# EAGLE design ugs preamp (EAGLE 6.3)
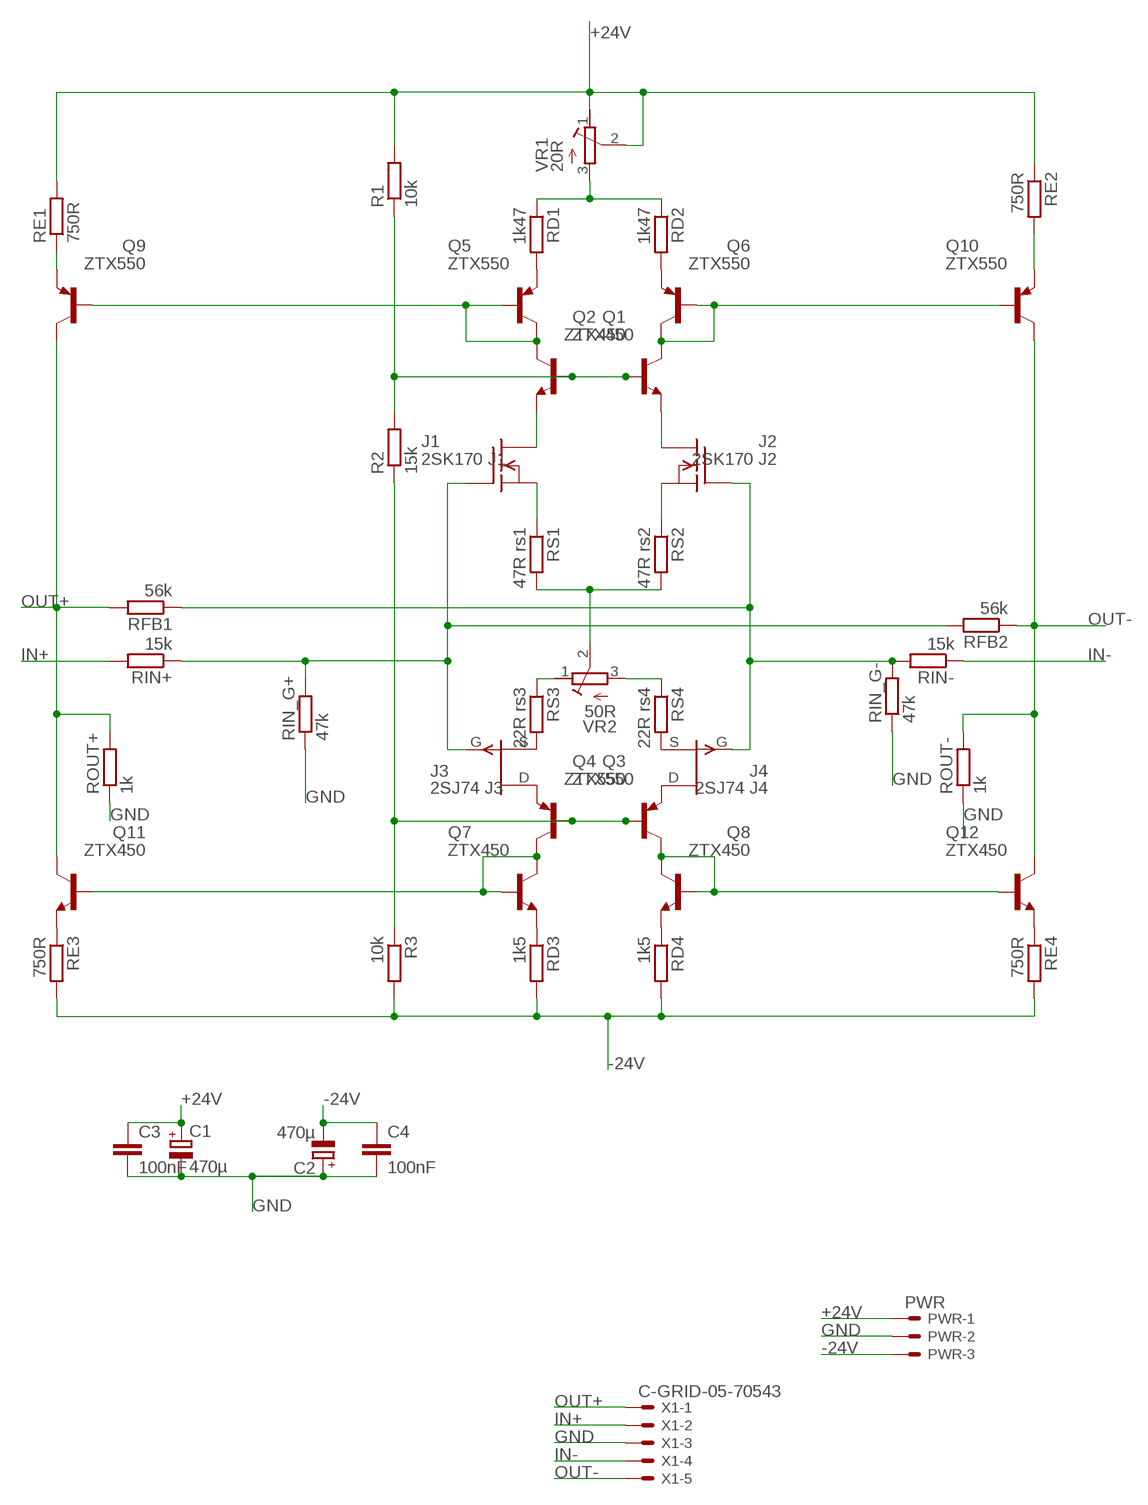
[diagram p0: schematic, sheet 1]

## Parts
C1  470µ  CPOL-EUE7.5-16  [E7,5-16]
C2  470µ  CPOL-EUE7.5-16  [E7,5-16]
C3  100nF  C-EU050-025X075  [C050-025X075]
C4  100nF  C-EU050-025X075  [C050-025X075]
J1  2SK170 J1  BSS101  [TO92]
J2  2SK170 J2  BSS101  [TO92]
J3  2SJ74 J3  2N3820  [TO92]
J4  2SJ74 J4  2N3820  [TO92]
PWR  PWR  C-GRID-03-70543  [70543-03]
Q1  ZTX450  -NPN-TO92-EBC  [TO92-EBC]
Q2  ZTX450  -NPN-TO92-EBC  [TO92-EBC]
Q3  ZTX550  BC328-16-PNP-TO92-EBC  [TO92-EBC]
Q4  ZTX550  BC328-16-PNP-TO92-EBC  [TO92-EBC]
Q5  ZTX550  BC328-16-PNP-TO92-EBC  [TO92-EBC]
Q6  ZTX550  BC328-16-PNP-TO92-EBC  [TO92-EBC]
Q7  ZTX450  -NPN-TO92-EBC  [TO92-EBC]
Q8  ZTX450  -NPN-TO92-EBC  [TO92-EBC]
Q9  ZTX550  BC328-16-PNP-TO92-EBC  [TO92-EBC]
Q10  ZTX550  BC328-16-PNP-TO92-EBC  [TO92-EBC]
Q11  ZTX450  -NPN-TO92-EBC  [TO92-EBC]
Q12  ZTX450  -NPN-TO92-EBC  [TO92-EBC]
R1  10k  R-EU_0207/10  [0207/10]
R2  15k  R-EU_0207/10  [0207/10]
R3  10k  R-EU_0207/10  [0207/10]
RD1  1k47  R-EU_0207/10  [0207/10]
RD2  1k47  R-EU_0207/10  [0207/10]
RD3  1k5  R-EU_0207/10  [0207/10]
RD4  1k5  R-EU_0207/10  [0207/10]
RE1  750R  R-EU_0207/10  [0207/10]
RE2  750R  R-EU_0207/10  [0207/10]
RE3  750R  R-EU_0207/10  [0207/10]
RE4  750R  R-EU_0207/10  [0207/10]
RFB1  56k  R-EU_0207/10  [0207/10]
RFB2  56k  R-EU_0207/10  [0207/10]
RIN+  15k  R-EU_0207/10  [0207/10]
RIN-  15k  R-EU_0207/10  [0207/10]
RIN_G+  47k  R-EU_0207/10  [0207/10]
RIN_G-  47k  R-EU_0207/10  [0207/10]
ROUT+  1k  R-EU_0207/10  [0207/10]
ROUT-  1k  R-EU_0207/10  [0207/10]
RS1  47R rs1  R-EU_0207/10  [0207/10]
RS2  47R rs2  R-EU_0207/10  [0207/10]
RS3  22R rs3  R-EU_0207/10  [0207/10]
RS4  22R rs4  R-EU_0207/10  [0207/10]
VR1  20R  R-TRIMMT93YA  [RTRIMT93YA]
VR2  50R  R-TRIMMT93YA  [RTRIMT93YA]
X1  C-GRID-05-70543  [70543-05]

## Nets
+24V [PWR]: C1.+ C3.1 PWR.1 R1.2 RE1.2 RE2.1 VR1.1(E) VR1.2(S)
-24V [PWR]: C2.- C4.1 PWR.3 R3.2 RD3.2 RD4.2 RE3.2 RE4.2
GND [PWR]: C1.- C2.+ C3.2 C4.2 PWR.2 RIN_G+.1 RIN_G-.1 ROUT+.1 ROUT-.1 X1.3
IN+: RIN+.2 X1.2
IN-: RIN-.1 X1.4
N$1: J3.3(D) Q3.E
N$2: RD1.1 RD2.1 VR1.3(A)
N$3: Q1.B Q2.B R1.1 R2.2
N$4: Q3.B Q4.B R2.1 R3.1
N$5: J4.3(D) Q4.E
N$6: J4.1(S) RS4.2
N$7: J3.1(S) RS3.2
N$8: Q10.E RE2.2
N$13: J2.2(G) J4.2(G) RFB1.1 RIN-.2 RIN_G-.2
N$14: RS1.2 RS2.2 VR2.2(S)
N$15: J2.1(S) RS2.1
N$18: Q5.E RD1.2
N$20: J1.1(S) RS1.1
N$21: RS3.1 VR2.1(E)
N$22: RS4.1 VR2.3(A)
N$23: J1.2(G) J3.2(G) RFB2.2 RIN+.1 RIN_G+.2
N$25: Q6.E RD2.2
N$26: Q11.E RE3.1
N$27: Q9.E RE1.1
N$30: Q8.E RD4.1
N$31: Q4.C Q8.B Q8.C Q12.B
N$32: Q7.E RD3.1
N$34: Q12.E RE4.1
N$35: Q2.C Q6.B Q6.C Q10.B
N$38: Q3.C Q7.B Q7.C Q11.B
N$39: J1.3(D) Q1.E
N$40: J2.3(D) Q2.E
N$41: Q1.C Q5.B Q5.C Q9.B
OUT+: Q9.C Q11.C RFB1.2 ROUT+.2 X1.1
OUT-: Q10.C Q12.C RFB2.1 ROUT-.2 X1.5

## Library data of the parts
C1 C2 = rcl:CPOL-EU: POLARIZED CAPACITOR, European symbol
C3 C4 = rcl:C-EU: CAPACITOR, European symbol
J1 J2 = transistor-fet:BSS101: N-Channel Enhancement MOSFET 200V; 0,16A; 11Ohm
J3 J4 = transistor-fet:2N3820: P-Channel Junction FET Source: http://www.fairchildsemi.com/ds/2N/2N3820.pdf
PWR = con-molex:C-GRID-03: CONNECTOR wire to board 2.54 mm (0.100") pitch header; OC_FARNELL: unknown; OC_NEWARK: unknown
Q1 Q2 Q7 Q8 Q11 Q12 = transistor:*-NPN-: NPN Transistror BF959 corrected 2008.03.06
Q3-Q6 Q9 Q10 = transistor:*-PNP-: PNP Transistror
R1-R3 RD1-RD4 RE1-RE4 RFB1 RFB2 RIN+ RIN- RIN_G+ RIN_G- ROUT+ ROUT- RS1-RS4 = rcl:R-EU_: RESISTOR, European symbol
VR1 VR2 = rcl:R-TRIMM: Trimm resistor
X1 = con-molex:C-GRID-05: CONNECTOR wire to board 2.54 mm (0.100") pitch header; OC_FARNELL: unknown; OC_NEWARK: unknown

## Net classes
0 Any: width 0.305 mm, clearance 0.152 mm
1 PWR: width 0.559 mm, clearance 0.152 mm

## Board
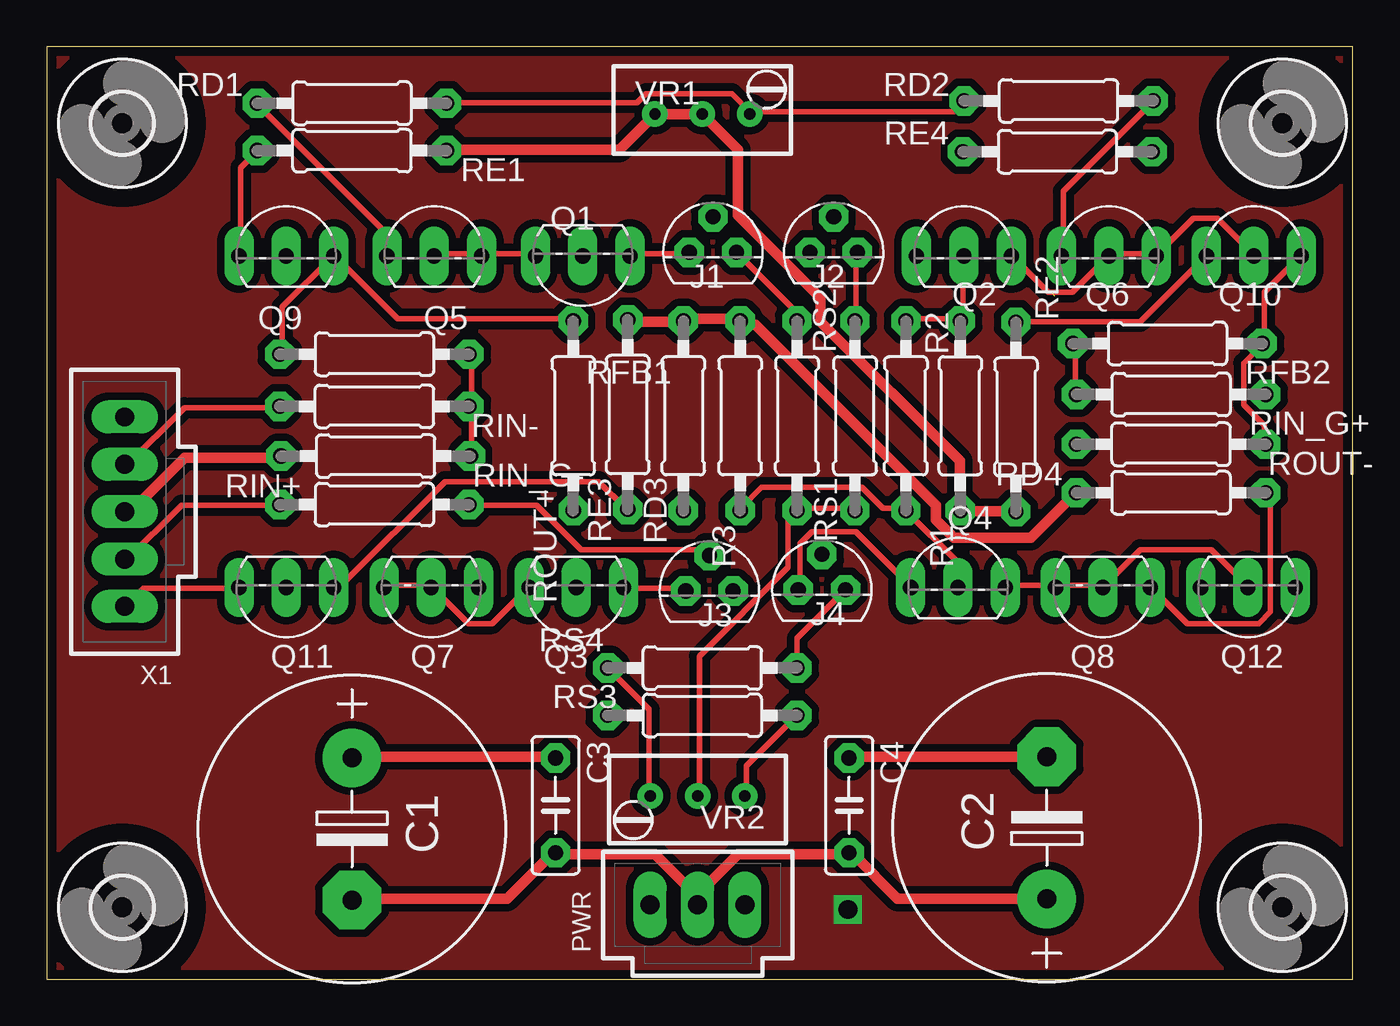
[diagram p1: board, top side]
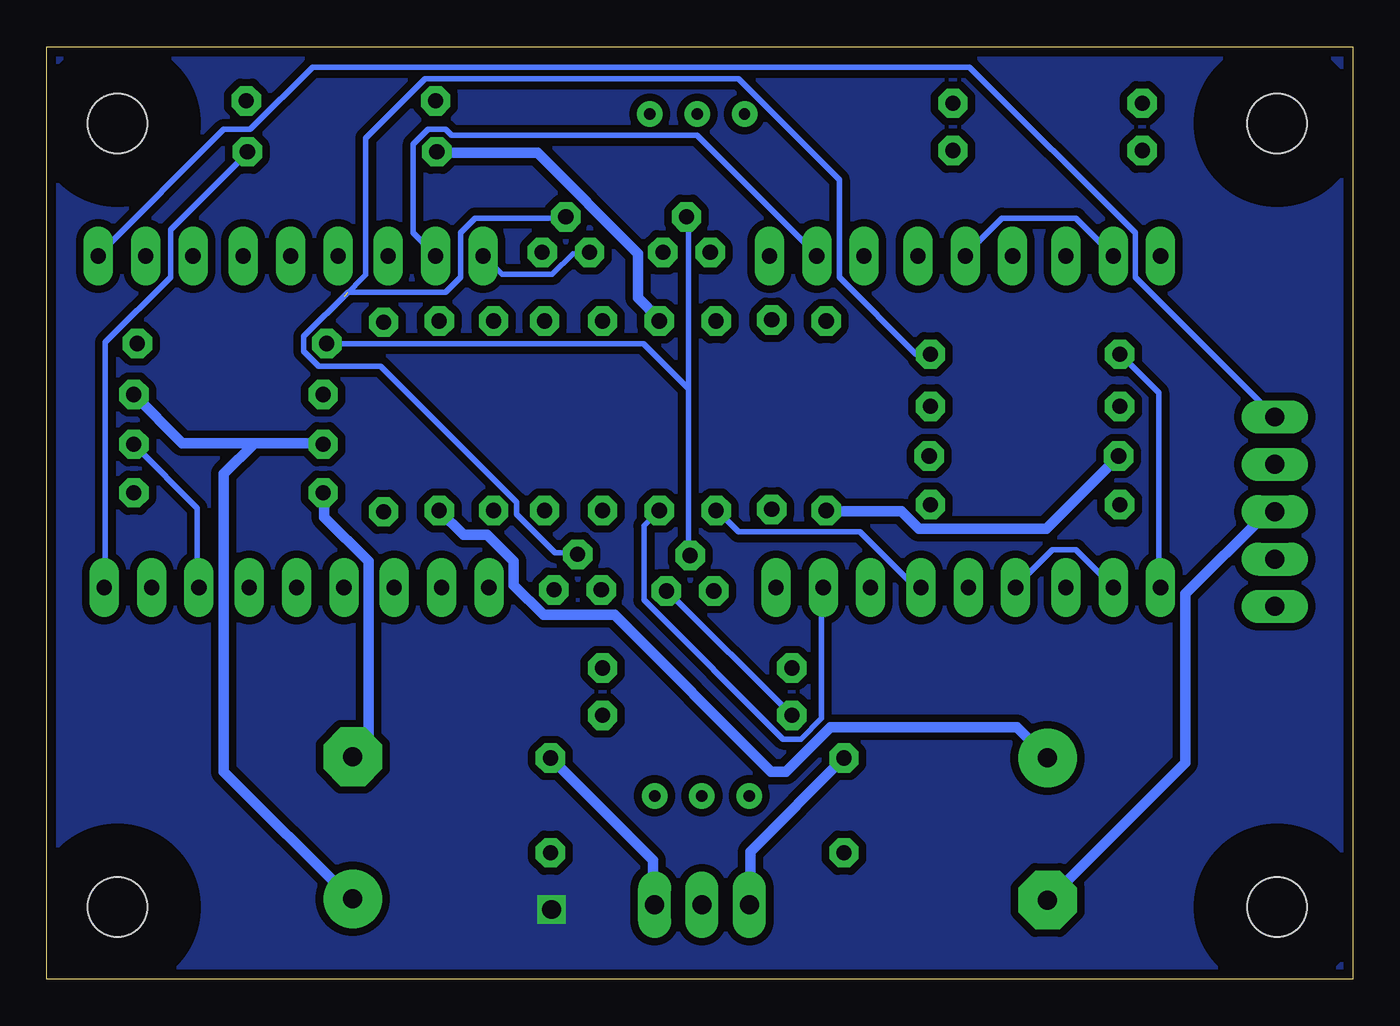
[diagram p2: board, bottom side, seen from below]

Size 70.08 x 50.03 mm. Coordinates in mm from the lower left corner, seen from the top.
Outline: 0,0 70.08,0 70.08,50.03 0,50.03 0,0
Copper layers (1*16): Top 0.035mm / dielectric 1.5mm / Bottom 0.035mm
Design rules "gael design rules": minimum track width 12mil, minimum drill 24mil, track to track 8mil, track to pad 8mil, pad to pad 8mil, via to via 8mil, smd to smd 8mil, copper to edge 20mil, drill to drill 8mil, minimum pad ring 15mil, minimum via ring 10mil, stop-mask expansion 4mil, vias tented up to drill 0mil, thermal gap 10mil

### Footprints (pad centres in the part's own frame; a part is rotated, then mirrored left to right if it is on the bottom)
E7,5-16 = drill 1.016 pad 3.15: + -3.81,0 | drill 1.016 pad 3.15 octagon: - 3.81,0
C050-025X075 = drill 0.813 octagon: 1 -2.54,0; 2 2.54,0
TO92 = drill 0.813 octagon: 1 1.27,0; 2 0,1.905; 3 -1.27,0
70543-03 = drill 1.016 long: 1 -2.54,0; 2 0,0; 3 2.54,0
TO92-EBC = drill 0.813 long: B 0,-1.27; C 2.54,-1.27; E -2.54,-1.27
0207/10 = drill 0.813 octagon: 1 -5.08,0; 2 5.08,0
3,2 = hole 3.2: 0,0
RTRIMT93YA = drill 0.61: 1 0,-2.54; 2 0,0; 3 0,2.54
70543-05 = drill 1.016 long: 1 -5.08,0; 2 -2.54,0; 3 0,0; 4 2.54,0; 5 5.08,0

### Placement (x,y rotation side)
C1  16.38,8.06 270 top
C2  53.66,8.13 90 top
C3  27.3,9.33 270 top
C4  43.05,9.33 270 top
J1  35.75,38.99 0 top
J2  42.23,38.99 0 top
J3  35.56,20.83 0 top
J4  41.59,20.89 0 top
PWR  34.92,4 0 top
Q1  28.77,37.53 180 top
Q2  49.21,40.07 0 top
Q3  28.42,19.75 180 top
Q4  48.89,22.29 0 top
Q5  20.8,40.07 0 top
Q6  56.99,40.07 0 top
Q7  20.64,19.75 180 top
Q8  56.67,19.75 180 top
Q9  12.86,40.07 0 top
Q10  64.77,40.07 0 top
Q11  12.86,19.75 180 top
Q12  64.45,19.75 180 top
R1  49.02,30.23 270 top
R2  46.1,30.23 90 top
R3  37.21,30.23 90 top
RD1  16.38,46.99 180 top
RD2  54.29,47.12 0 top
RD3  34.16,30.23 90 top
RD4  60.32,26.1 180 top
RE1  16.38,44.45 0 top
RE2  52.01,30.16 90 top
RE3  31.18,30.29 90 top
RE4  54.23,44.39 180 top
RFB1  17.59,33.53 180 top
RFB2  60.13,34.1 180 top
RIN+  17.59,25.46 180 top
RIN-  17.59,30.73 0 top
RIN_G+  60.32,31.37 180 top
RIN_G-  17.65,28.07 0 top
ROUT+  28.26,30.23 90 top
ROUT-  60.32,28.7 0 top
RS1  40.26,30.23 270 top
RS2  43.37,30.23 270 top
RS3  35.18,14.16 180 top
RS4  35.18,16.7 0 top
U$1  [3,2]  4.06,45.91 0 top
U$2  [3,2]  66.29,45.91 0 top
U$3  [3,2]  66.29,3.87 0 top
U$4  [3,2]  4.06,3.87 0 top
VR1  35.18,46.42 270 top
VR2  34.92,9.84 90 top
X1  4.19,25.08 90 top

### Tracks (layer width: path | path; a pad name or v marks a point on that pad's centre or on a via)
+24V
  Top 0.559: C3.1 27.24,11.94 16.45,11.94 C1.+ | RE2.1 52.01,25.11 49.15,25.11 R1.2 48.99,25.43 48.99,27.81 41.53,35.27 41.53,36.54 37.08,40.99 37.08,44.48 35.34,46.23 VR1.2 35.18,46.39 32.64,46.39 VR1.1 32.48,46.23 30.73,44.48 21.53,44.48 RE1.2
  Bottom 0.559: C3.1 32.32,6.86 32.32,4 PWR.1 | R1.2 47.72,23.84 46.45,23.84 45.02,22.42 45.02,21.15 43.43,19.56 39.62,19.56 31.21,11.14 30.42,11.14 28.04,13.53 18.03,13.53 C1.+
-24V
  Top 0.559: RE3.2 31.21,35.27 33.91,35.27 RD3.2 34.23,35.43 37.08,35.43 R3.2 37.4,35.12 38.04,35.12 47.72,25.43 47.72,24.64 48.67,23.69 52.8,23.69 55.18,26.07 RD4.2 | C2.- 43.12,11.94 C4.1
  Bottom 0.559: RE4.2 49.15,44.32 43.75,44.32 38.35,38.93 38.35,36.54 37.24,35.43 R3.2 | RD4.2 55.18,26.07 55.18,24.8 52.8,22.42 52.8,12.73 53.59,11.94 C2.- | C4.1 37.56,6.38 37.56,4 PWR.3
GND
  Top 0.559: RIN_G-.1 12.48,27.97 7.4,27.97 4.54,25.11 4.22,25.11 X1.3 | C1.- 16.45,4.32 24.7,4.32 27.08,6.7 C3.2 27.4,6.7 32.64,6.7 34.86,4.48 34.86,4 PWR.2 35.02,4.64 37.08,6.7 42.96,6.7 C4.2 43.27,6.7 45.66,4.32 C2.+
  Bottom 0.559: ROUT+.1 28.19,25.11 24.22,25.11 23.27,24.16 16.45,24.16 12.64,27.97 RIN_G-.1 | 58.93,28.77 62.8,28.77 RIN_G+.1 | 58.93,28.77 55.34,28.77 ROUT-.1 | C2.+ 53.75,4.32 60.58,11.14 60.58,27.11 58.93,28.77 | X1.3 4.22,24.96 4.7,24.96 8.98,20.67 8.98,11.62 16.29,4.32 C1.-
IN+
  Top 0.305: RIN+.2 12.48,25.43 7.24,25.43 4.22,22.42 X1.2
IN-
  Top 0.305: RIN-.1 12.48,30.67 7.4,30.67 4.22,27.5 X1.4
N$1
  Top 0.305: Q3.E 31.05,20.99 34.07,20.99 34.23,20.83 J3.3
N$2
  Top 0.305: 37.72,46.55 48.67,46.55 49.15,47.02 RD2.1 | 37.72,46.55 36.77,47.5 32.16,47.5 31.69,47.02 21.53,47.02 RD1.1 | 37.72,46.55 VR1.3
N$3
  Top 0.305: R2.2 46.13,35.43 48.99,35.43 R1.1 49.15,35.43 49.15,38.77 Q2.B
  Bottom 0.305: Q1.B 28.83,38.93 35.18,45.28 48.35,45.28 48.67,45.59 49.62,45.59 50.42,44.8 50.42,40.04 49.31,38.93 Q2.B
N$4
  Top 0.305: Q4.B 48.83,21.15 48.83,22.42 R2.1 45.97,25.27 44.86,25.27 43.75,26.38 38.35,26.38 37.24,25.27 R3.1
  Bottom 0.305: R3.1 38.04,24.32 38.04,20.35 30.57,12.89 29.62,12.89 28.51,14 28.51,20.99 Q3.B
N$5
  Top 0.305: J4.3 40.42,20.99 40.42,23.37 41.05,24 43.43,24 46.29,21.15 Q4.E
N$6
  Top 0.305: RS4.2 40.26,18.29 J4.1
N$7
  Bottom 0.305: RS3.2 36.77,20.83 J3.1
N$8
  Top 0.305: RE2.2 52.01,35.27 58.67,35.27 62.17,38.77 Q10.E
N$13  (1 unrouted)
  Top 0.305: RIN_G-.2 22.8,28.13 22.8,30.67 RIN-.2 22.8,30.83 22.8,33.53 RFB1.1
  Bottom 0.305: J4.2 41.69,22.89 42.8,22.89 44.86,24.96 44.86,25.59 52.16,32.89 55.5,32.89 56.29,33.69 56.29,34.48 53.91,36.86 48.67,36.86 47.88,37.66 47.88,40.04 47.09,40.83 42.32,40.83 J2.2 | RFB1.1 23.43,33.53 27.56,37.66 27.56,42.89 32.96,48.29 49.78,48.29 52.96,45.12 52.96,37.78 54.1,36.64
N$14
  Top 0.305: VR2.2 35.02,9.87 35.02,17.34 39.78,22.1 39.78,24.64 40.26,25.11 RS1.2 40.26,25.27 43.27,25.27 RS2.2
N$15
  Top 0.305: RS2.1 43.43,35.43 43.43,38.93 J2.1
N$18
  Top 0.305: Q5.E 18.19,38.93 18.19,40.04 11.37,46.86 RD1.2
N$20
  Top 0.305: RS1.1 40.26,35.75 J1.1
N$21
  Top 0.305: RS3.1 37.56,11.46 37.56,9.87 VR2.1
N$22
  Top 0.305: RS4.1 32.32,14.48 32.32,9.87 VR2.3
N$23
  Top 0.305: RIN_G+.2 55.18,31.46 55.18,34 RFB2.2 | RIN+.1 22.8,25.43 26.29,25.43 28.67,23.05 35.18,23.05 35.5,22.73 J3.2
  Bottom 0.305: 35.66,31.69 35.66,22.73 J3.2 | 35.66,31.69 35.66,40.8 J1.2 | 55.02,34 RFB2.2 38.07,34.1 35.66,31.69
N$25
  Top 0.305: Q6.E 54.55,38.93 54.55,42.26 59.31,47.02 RD2.2
N$26
  Top 0.305: Q11.E 15.49,21.15 15.81,21.15 21.37,26.7 29.62,26.7 31.05,25.27 RE3.1
N$27
  Top 0.305: Q9.E 10.41,38.93 10.41,43.53 11.21,44.32 RE1.1
N$30
  Top 0.305: Q8.E 59.31,20.99 61.21,19.08 65.02,19.08 65.66,19.72 65.66,25.91 65.5,26.07 RD4.1
N$31
  Top 0.305: Q4.C 51.53,21.15 54.07,21.15 Q8.C 54.23,21.15 56.61,21.15 Q8.B 56.77,21.15 58.67,23.05 62.48,23.05 64.39,21.15 Q12.B
N$32
  Bottom 0.305: Q7.E 23.27,21.15 23.59,21.15 26.45,24 32.96,24 34.07,25.11 RD3.1
N$34
  Bottom 0.305: Q12.E 66.93,21.15 66.93,34.16 63.44,37.66 63.44,40.2 59.31,44.32 RE4.1
N$35
  Top 0.305: Q2.C 51.85,38.77 53.75,36.86 55.02,36.86 56.93,38.77 Q6.B 57.09,38.93 59.47,38.93 Q6.C 59.63,38.93 61.53,40.83 62.8,40.83 64.71,38.93 Q10.B
N$38
  Top 0.305: Q7.C 18.19,21.15 20.57,21.15 Q7.B 20.73,20.99 22.64,19.08 23.91,19.08 25.81,20.99 Q3.C
  Bottom 0.305: Q11.B 12.95,21.15 14.86,23.05 16.13,23.05 18.03,21.15 Q7.C
N$39
  Top 0.305: Q1.E 31.37,38.93 34.38,38.93 J1.3
N$40
  Bottom 0.305: J2.3 41.05,38.93 41.85,38.93 42.96,37.81 45.66,37.81 46.61,38.77 Q2.E
N$41
  Top 0.305: Q5.B 20.89,38.93 23.27,38.93 Q5.C 23.43,38.93 26.13,38.93 Q1.C
  Bottom 0.305: Q9.B 12.95,38.93 14.86,40.83 18.83,40.83 20.73,38.93 Q5.B
OUT+
  Top 0.305: X1.1 5.17,20.99 10.25,20.99 Q11.C | RFB1.2 12.64,33.53 12.64,36.07 15.34,38.77 Q9.C 15.49,38.77 18.83,35.43 28.19,35.43 ROUT+.2
  Bottom 0.305: Q11.C 10.41,21.15 10.41,31.46 12.48,33.53 RFB1.2
OUT-
  Top 0.305: Q10.C 67.25,38.77 65.34,36.86 65.34,34.16 RFB2.1 65.18,34 64.23,33.05 64.23,30.83 65.34,29.72 65.34,28.77 ROUT-.2
  Bottom 0.305: Q12.C 62.01,21.15 62.01,25.27 65.34,28.61 ROUT-.2 | X1.5 11.68,37.66 11.68,40.04 20.57,48.93 55.82,48.93 59.15,45.59 60.58,45.59 67.25,38.93 Q10.C
SHIELD  (via drill 1)
  other vias: 42.99,3.75
  pour Top (isolate 0.406): 0.13,49.78 69.98,49.78 69.98,0.19 0.13,0.19
  pour Bottom (isolate 0.406): 0.13,49.78 69.98,49.78 69.98,0.19 0.13,0.19

### Text on the board
tValues: O- | I- | 0V | I+ | O+ | UGS PREAMP Gael v1 | +24V | -24V | Shield